# EAGLE design Charger (EAGLE 6.1)
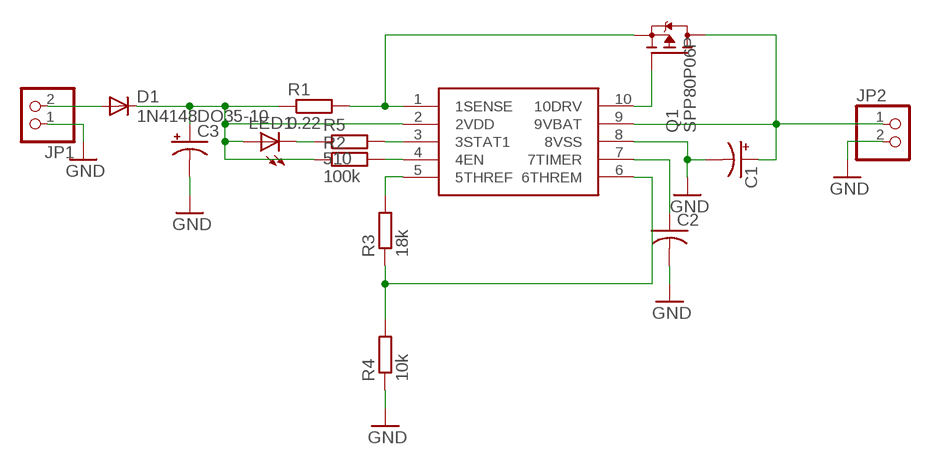
[diagram p0: schematic, sheet 1]

## Parts
C1  CPOL-US153CLV-0505  [153CLV-0505]
C2  C-USC0805  [C0805]
C3  CPOL-US153CLV-0505  [153CLV-0505]
D1  1N4148DO35-10  [DO35-10]
JP1  PINHD-1X2  [1X02]
JP2  PINHD-1X2  [1X02]
LED1  LEDCHIPLED_1206  [CHIPLED_1206]
Q1  SPP80P06P  [TO220]
R1  0.22  R-EU_R0805  [R0805]
R2  100k  R-EU_R0805  [R0805]
R3  18k  R-EU_R0805  [R0805]
R4  10k  R-EU_R0805  [R0805]
R5  510  R-EU_R0805  [R0805]
U$1  MCP73841  [MSOP10]

## Nets
GND: C1.- C2.2 C3.- JP1.1 JP2.2 R4.1 U$1.8(8VSS)
N$1: C3.+ D1.C LED1.A R1.1 R2.1 U$1.2(2VDD)
N$2: Q1.3(S) R1.2 U$1.1(1SENSE)
N$3: R2.2 U$1.4(4EN)
N$4: LED1.C R5.1
N$5: Q1.1(G) U$1.10(10DRV)
N$6: R5.2 U$1.3(3STAT1)
N$7: C1.+ JP2.1 Q1.2(D) U$1.9(9VBAT)
N$8: C2.1 U$1.7(7TIMER)
N$10: D1.A JP1.2
N$11: R3.2 U$1.5(5THREF)
N$12: R3.1 R4.2 U$1.6(6THREM)

## Library data of the parts
C1 C3 = resistor:CPOL-US: POLARIZED CAPACITOR, American symbol
C2 = resistor:C-US: CAPACITOR, American symbol
D1 = diode:1N4148: DIODE high speed (Philips)
JP1 JP2 = pinhead:PINHD-1X2: PIN HEADER
LED1 = led:LED: LED OSRAM: - CHIPLED LG R971, LG N971, LY N971, LG Q971, LY Q971, LO R971, LY R971 LH N974, LH R974 LS Q976, LO Q976, LY Q976 LO Q996 - Hyper CHIPLED LW Q18S LB Q993, LB Q99A, LB R99A - SideLED LS A670, LO A670, LY A670, LG A670, LP A670 LB A673, LV A673, LT A673, LW A673 LH A674 LY A675 LS A676, LA A676, LO A676, LY A676, LW A676 LS A679, LY A679, LG A679 - Hyper Micro SIDELED® LS Y876, LA Y876, LO Y876, LY Y876 LT Y87S - SmartLED LW L88C, LW L88S LB L89C, LB L89S, LG L890 LS L89K, LO L89K, LY L89K LS L896, LA L896, LO L896, LY L896 - TOPLED LS T670, LO T670, LY T670, LG T670, LP T670 LSG T670, LSP T670, LSY T670, LOP T670, LYG T670 LG T671, LOG T671, LSG T671 LB T673, LV T673, LT T673, LW T673 LH T674 LS T676, LA T676, LO T676, LY T676, LB T676, LH T676, LSB T676, LW T676 LB T67C, LV T67C, LT T67C, LS T67K, LO T67K, LY T67K, LW E67C LS E67B, LA E67B, LO E67B, LY E67B, LB E67C, LV E67C, LT E67C LW T67C LS T679, LY T679, LG T679 LS T770, LO T770, LY T770, LG T770, LP T770 LB T773, LV T773, LT T773, LW T773 LH T774 LS E675, LA E675, LY E675, LS T675 LS T776, LA T776, LO T776, LY T776, LB T776 LHGB T686 LT T68C, LB T68C - Hyper Mini TOPLED® LB M676 - Mini TOPLED Santana® LG M470 LS M47K, LO M47K, LY M47K Source: http://www.osram.convergy.de LUXEON: - LUMILED® LXK2-PW12-R00, LXK2-PW12-S00, LXK2-PW14-U00, LXK2-PW14-V00 LXK2-PM12-R00, LXK2-PM12-S00, LXK2-PM14-U00 LXK2-PE12-Q00, LXK2-PE12-R00, LXK2-PE12-S00, LXK2-PE14-T00, LXK2-PE14-U00 LXK2-PB12-K00, LXK2-PB12-L00, LXK2-PB12-M00, LXK2-PB14-N00, LXK2-PB14-P00, LXK2-PB14-Q00 LXK2-PR12-L00, LXK2-PR12-M00, LXK2-PR14-Q00, LXK2-PR14-R00 LXK2-PD12-Q00, LXK2-PD12-R00, LXK2-PD12-S00 LXK2-PH12-R00, LXK2-PH12-S00 LXK2-PL12-P00, LXK2-PL12-Q00, LXK2-PL12-R00 Source: www.luxeon.com KINGBRIGHT: KA-3528ASYC Source: www.kingbright.com
Q1 = transistor-fet:SPP80P06P: SIPMOS(R) Power-Transistor P-Channel, Enhancement mode Source: http://www.infineon.com/upload/Document/cmc_upload/documents/012/3619/SPP80P06P.pdf
R1-R5 = resistor:R-EU_: RESISTOR, European symbol
U$1 = mcp73841:MCP73841

## Board
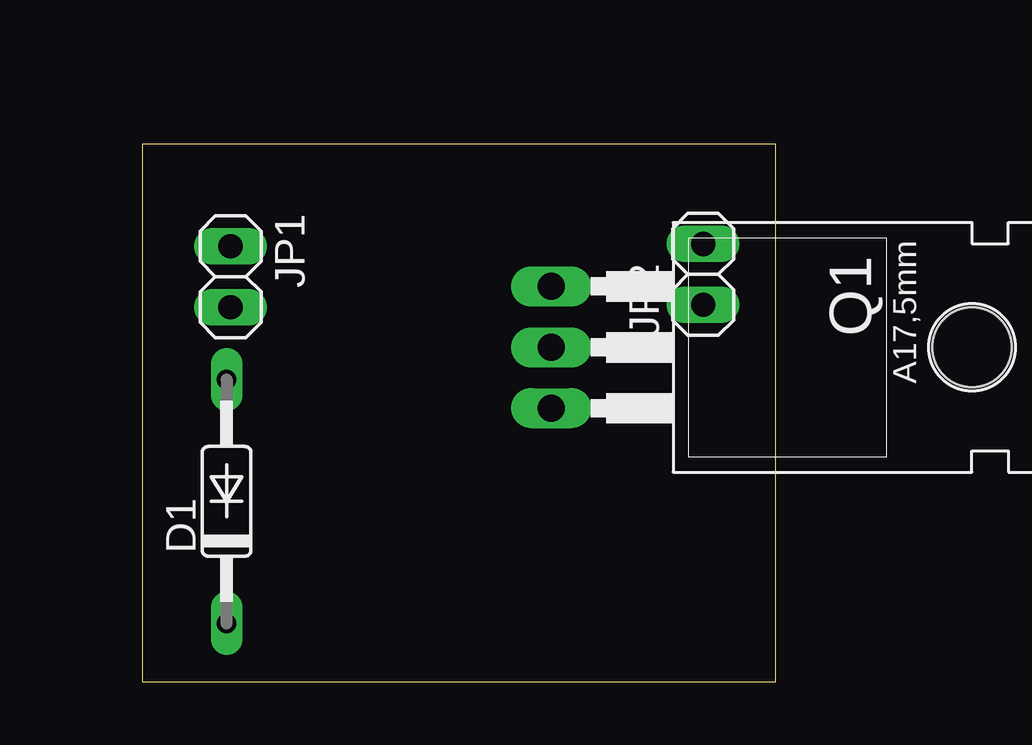
[diagram p1: board, top side]
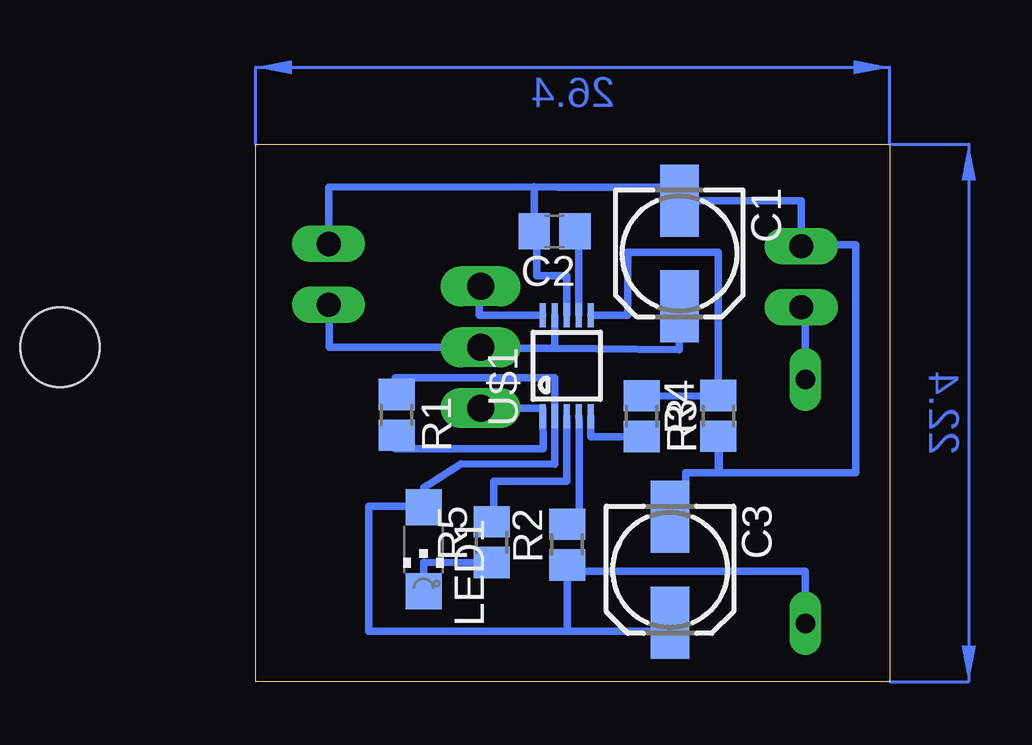
[diagram p2: board, bottom side, seen from below]

Size 26.4 x 22.4 mm. Coordinates in mm from the lower left corner, seen from the top.
Outline: 0,0 26.4,0 26.4,22.4 0,22.4 0,0
Copper layers (1*16): Top 0.035mm / dielectric 1.5mm / Bottom 0.035mm
Design rules: minimum track width 10mil, minimum drill 24mil, track to track 8mil, track to pad 8mil, pad to pad 8mil, via to via 8mil, smd to smd 8mil, copper to edge 40mil, drill to drill 8mil, minimum pad ring 10mil, minimum via ring 8mil, stop-mask expansion 4mil, vias tented up to drill 0mil, thermal gap 10mil

### Footprints (pad centres in the part's own frame; a part is rotated, then mirrored left to right if it is on the bottom)
153CLV-0505 = smd 3 x 1.6: + 2.2,0; - -2.2,0
C0805 = smd 1.3 x 1.5: 1 -0.85,0; 2 0.85,0
DO35-10 = drill 0.813 long: A 5.08,0; C -5.08,0
1X02 = drill 1.016 long: 1 -1.27,0; 2 1.27,0
CHIPLED_1206 = smd 1.5 x 1.5: A 0,-1.75; C 0,1.75
TO220 = drill 1.118 long: 1 -2.54,-6.35; 2 0,-6.35; 3 2.54,-6.35 | hole 3.302: 0,11.176
R0805 = smd 1.3 x 1.5: 1 -0.85,0; 2 0.85,0
MSOP10 = smd 0.25 x 1: 1 -1,-2.113; 2 -0.5,-2.113; 3 0,-2.113; 4 0.5,-2.113; 5 1,-2.113; 6 1,2.113; 7 0.5,2.113; 8 0,2.113; 9 -0.5,2.113; 10 -1,2.113

### Placement (x,y rotation side)
C1  8.76,17.84 270 bottom
C2  13.96,18.76 180 bottom
C3  9.15,4.66 270 bottom
D1  3.51,7.51 90 top
JP1  3.68,16.87 270 top
JP2  23.37,16.97 90 top
LED1  19.42,5.51 180 bottom
Q1  23.39,13.93 270 top
R1  20.54,11.11 270 bottom
R2  13.44,5.71 90 bottom
R3  10.33,11.06 270 bottom
R4  7.13,11.07 90 bottom
R5  16.58,5.81 90 bottom
U$1  13.45,13.16 0 bottom

### Tracks (layer width: path | path; a pad name or v marks a point on that pad's centre or on a via)
GND
  Bottom 0.305: JP2.2 23.36,20.6 14.8,20.61 | 14.8,20.61 13.8,20.6 8.76,20.6 C1.- 3.68,20.04 JP1.1 3.68,18.2 1.4,18.2 1.4,8.7 7.13,8.7 R4.1 7.1,9.92 7.09,8.7 8.49,8.7 8.5,6.9 C3.- | 14.8,20.61 C2.2 14.7,18.76 14.7,16.9 13.45,16.9 U$1.8 | U$1.8 | U$1.8
N$1
  Bottom 0.305: R2.1 13.5,4.76 | 13.44,2.1 21.7,2.1 21.7,7.3 20.22,7.3 LED1.A 19.42,8.07 17.85,9.07 13.95,9.05 U$1.2 13.95,12.66 20.6,12.65 20.6,11.96 R1.1 | R2.1 13.44,2.1 | D1.C 3.51,4.6 13.44,4.6 R2.1 | C3.+ 9.15,2.1 13.44,2.1
N$2
  Bottom 0.305: R1.2 20.6,10.26 20.6,9.7 14.44,9.7 14.45,11.2 U$1.1 14.45,11.39 Q1.3
N$3
  Bottom 0.305: U$1.4 12.94,10.85 12.94,7.02 13.44,7.02 R2.2
N$4
  Bottom 0.305: LED1.C 19.41,4.97 R5.1
N$5
  Bottom 0.305: U$1.10 17.1,15.27 17.1,16.47 | Q1.1 17.1,16.47 | 17.1,16.47 17.1,16.5
N$6
  Bottom 0.305: U$1.3 13.45,8.35 16.5,8.35 16.5,6.7 16.48,6.7 R5.2
N$7
  Bottom 0.305: JP2.1 23.35,15.7 23.35,13.94 Q1.2 17.04,13.94 17.03,13.94 Q1.2 17.1,13.93 17.1,13.88 13.95,13.88 | U$1.9 13.95,13.88 | C1.+ 8.76,13.83 13.95,13.88
N$8
  Bottom 0.305: U$1.7 12.95,17.95 13,18.55 13,18.71 C2.1
N$10
  Bottom 0.305: JP1.2 3.51,15.6 D1.A
N$11
  Bottom 0.305: R3.2 12.45,10.21 U$1.5
N$12
  Bottom 0.305: R3.1 9.83,11.6 9.8,11.9 7.2,11.92 R4.2 7.13,17.9 10.9,17.9 10.9,15.27 U$1.6
(copper drawn outside any net)
  shapes: Bottom area x2